# Altium schematic sheet micro_conflict-20171010-153445.SchDoc
size A4
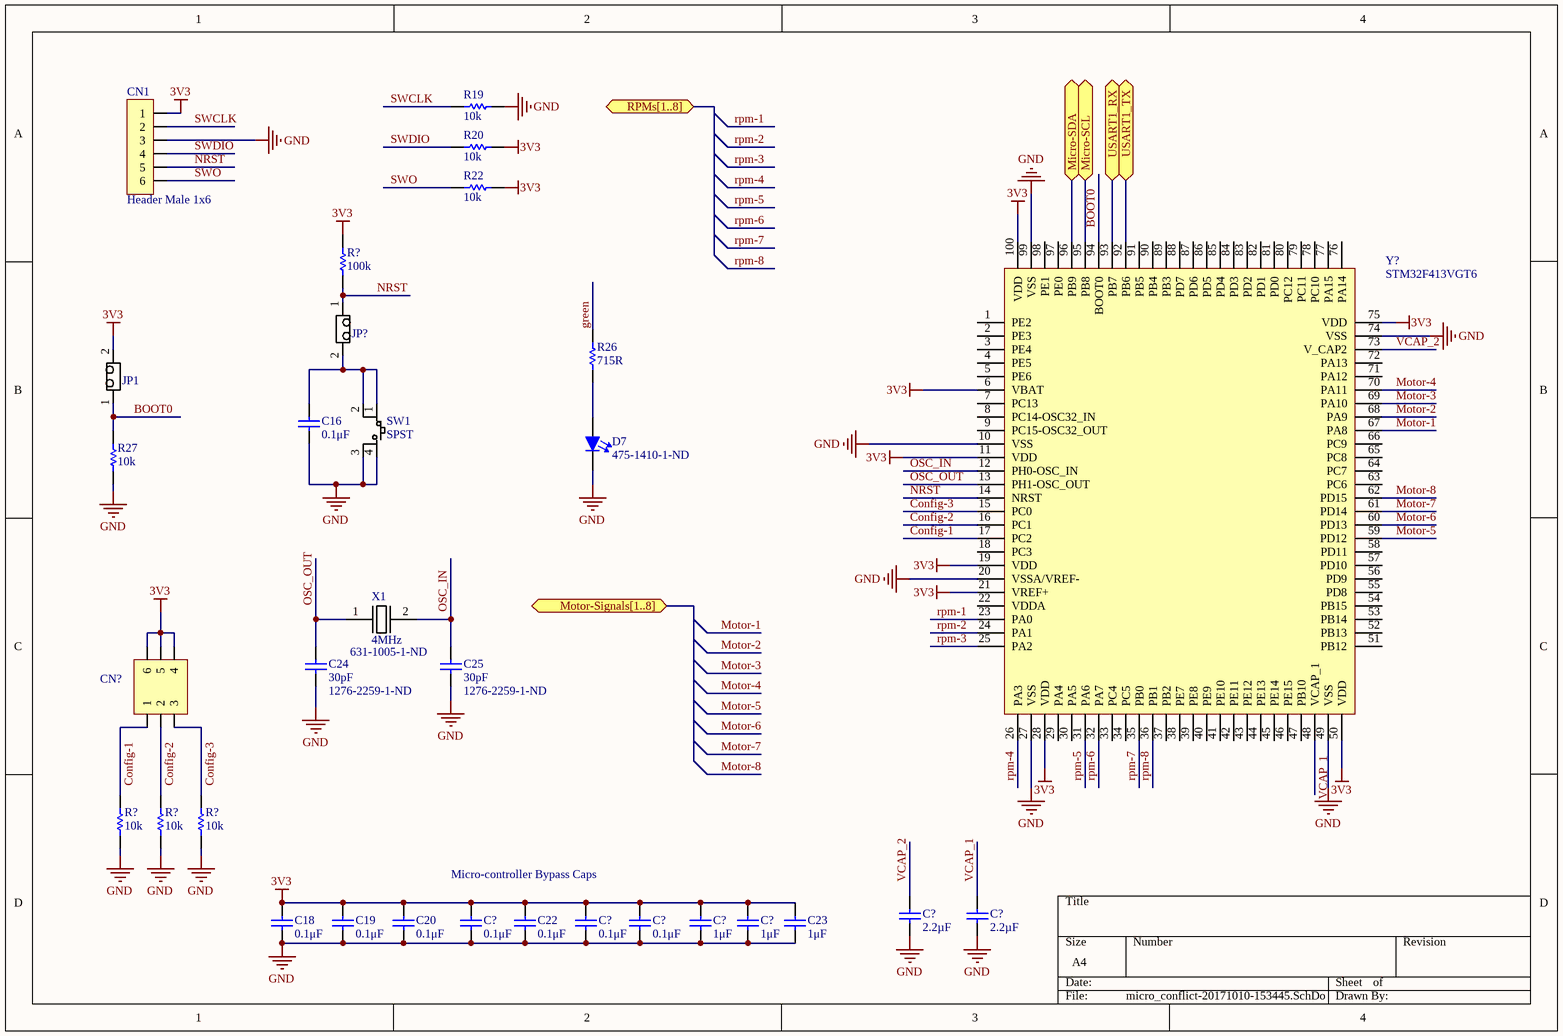
[diagram p0: micro_conflict-20171010-153445.SchDoc]

## Parts
(Parts that share a designator on the sheet are numbered #1, #2 ... from top to bottom, then left to right.)
C16  0.1μF  [CAPC1608N(0603")]
C18  0.1μF  [CAPC1608N(0603")]
C19  0.1μF  [CAPC1608N(0603")]
C20  0.1μF  [CAPC1608N(0603")]
C22  0.1μF  [CAPC1608N(0603")]
C23  1μF  [CAPC1608N(0603")]
C24  30pF  Supplier Part Number 1: 1276-2259-1-ND  [CAPC1608N(0603")]
C25  30pF  Supplier Part Number 1: 1276-2259-1-ND  [CAPC1608N(0603")]
C?#1  2.2µF  [CAPC1608N(0603")]
C?#2  2.2µF  [CAPC1608N(0603")]
C?#3  0.1μF  [CAPC1608N(0603")]
C?#4  0.1μF  [CAPC1608N(0603")]
C?#5  0.1μF  [CAPC1608N(0603")]
C?#6  1μF  [CAPC1608N(0603")]
C?#7  1μF  [CAPC1608N(0603")]
CN1  Header Male 1x6  [Header, Male, 1X6]
CN?  Header, Male, 2x3, Pitch: 0.1" (2.54mm), THT  [Header, Male, 2x3, Pitch: 0.1" (2.54mm),THT]  (value not drawn)
D7  Supplier Part Number 1: 475-1410-1-ND  [LED0805]  (hidden comment: Red)
JP1  1X2 Pin Head  [2X1 Males Header]  (value not drawn)
JP?  1X2 Pin Head  [2X1 Males Header]  (value not drawn)
R19  10k  [RESC1608N(0603")]
R20  10k  [RESC1608N(0603")]
R22  10k  [RESC1608N(0603")]
R26  715R  [RESC1608N(0603")]
R27  10k  [RESC1608N(0603")]
R?#1  100k  [RESC1608N(0603")]
R?#2  10k  [RESC1608N(0603")]
R?#3  10k  [RESC1608N(0603")]
R?#4  10k  [RESC1608N(0603")]
SW1  SPST  [4-SPST-NO]
X1  4MHz  Supplier Part Number 1: 631-1005-1-ND  [HC49/US]
Y?  STM32F413VGT6  [STM-LQFP100_M]

## Ports
Micro-SCL, Micro-SDA, Motor-Signals[1..8], RPMs[1..8], USART1_RX, USART1_TX

## Nets
3V3: C18.2(Cathode) C19.2(Cathode) C20.2(Cathode) C22.2(Cathode) C23.2(Cathode) C?#3.2(Cathode) C?#4.2(Cathode) C?#5.2(Cathode) C?#6.2(Cathode) C?#7.2(Cathode) CN1.1 CN?.4 CN?.5 CN?.6 JP1.2 R20.2 R22.2 R?#1.2 Y?.6(VBAT) Y?.11(VDD) Y?.19(VDD) Y?.21(VREF+) Y?.28(VDD) Y?.50(VDD) Y?.75(VDD) Y?.100(VDD)
GND: C16.1(Anode) C18.1(Anode) C19.1(Anode) C20.1(Anode) C22.1(Anode) C23.1(Anode) C24.1 C25.1 C?#1.1(Anode) C?#2.1(Anode) C?#3.1(Anode) C?#4.1(Anode) C?#5.1(Anode) C?#6.1(Anode) C?#7.1(Anode) CN1.3 D7.K(Cathode) R19.1 R27.1 R?#2.1 R?#3.1 R?#4.1 SW1.3 SW1.4 Y?.10(VSS) Y?.20(VSSA/VREF-) Y?.27(VSS) Y?.49(VSS) Y?.74(VSS) Y?.99(VSS)
BOOT0: JP1.1 R27.2 Y?.94(BOOT0)
Config-1: CN?.1 R?#2.2 Y?.17(PC2)
Config-2: CN?.2 R?#3.2 Y?.16(PC1)
Config-3: CN?.3 R?#4.2 Y?.15(PC0)
green: R26.2
Micro-SCL: Y?.95(PB8) ; port Micro-SCL
Micro-SDA: Y?.96(PB9) ; port Micro-SDA
Motor-1: Y?.67(PA8)
Motor-2: Y?.68(PA9)
Motor-3: Y?.69(PA10)
Motor-4: Y?.70(PA11)
Motor-5: Y?.59(PD12)
Motor-6: Y?.60(PD13)
Motor-7: Y?.61(PD14)
Motor-8: Y?.62(PD15)
NRST: CN1.5 JP?.1 R?#1.1 Y?.14(NRST)
OSC_IN: C25.2 X1.2 Y?.12(PH0-OSC_IN)
OSC_OUT: C24.2 X1.1 Y?.13(PH1-OSC_OUT)
rpm-1: Y?.23(PA0)
rpm-2: Y?.24(PA1)
rpm-3: Y?.25(PA2)
rpm-4: Y?.26(PA3)
rpm-5: Y?.31(PA6)
rpm-6: Y?.32(PA7)
rpm-7: Y?.35(PB0)
rpm-8: Y?.36(PB1)
SWCLK: CN1.2 R19.2
SWDIO: CN1.4 R20.1
SWO: CN1.6 R22.1
USART1_RX: Y?.93(PB7) ; port USART1_RX
USART1_TX: Y?.92(PB6) ; port USART1_TX
VCAP_1: C?#2.2(Cathode) Y?.48(VCAP_1)
VCAP_2: C?#1.2(Cathode) Y?.73(V_CAP2)
NetC16_2: C16.2(Cathode) JP?.2 SW1.1 SW1.2
NetD7_A: D7.A(Anode) R26.1

Not connected (* = marked no-connect by the designer): Y? 1(PE2) 2(PE3) 3(PE4) 4(PE5) 5(PE6) 7(PC13) 8(PC14-OSC32_IN) 9(PC15-OSC32_OUT) 18(PC3) 22(VDDA) 29(PA4) 30(PA5) 33(PC4) 34(PC5) 37(PB2) 38(PE7) 39(PE8) 40(PE9) 41(PE10) 42(PE11) 43(PE12) 44(PE13) 45(PE14) 46(PE15) 47(PB10) 51(PB12) 52(PB13) 53(PB14) 54(PB15) 55(PD8) 56(PD9) 57(PD10) 58(PD11) 63(PC6) 64(PC7) 65(PC8) 66(PC9) 71(PA12) 72(PA13) 76(PA14) 77(PA15) 78(PC10) 79(PC11) 80(PC12) 81(PD0) 82(PD1) 83(PD2) 84(PD3) 85(PD4) 86(PD5) 87(PD6) 88(PD7) 89(PB3) 90(PB4) 91(PB5) 97(PE0) 98(PE1)

## Notes on the sheet
- Micro-controller Bypass Caps

## Library data of the parts
C16 C18-C20 C22 C?#3-C?#5 = 0.1uF 100V 0603 SMD, Ceramic: Capacitor, Ceramic, 100V, +/- 10%, 0603 SMD, X7R; MFG: TDK; MFG#: CGA3E3X7S2A104K080AB; Published: 16-04-26; Publisher: AUVic; PackageDescription: Chip Capacitor; Value: 0.1μF; Created By: Ashwin Sira; Supplier 1: Digi-Key; Supplier Part Number 1: 445-6938-1-ND
C23 C?#6 C?#7 = 1uF 25V 0603 SMD, Ceramic: Capacitor, Ceramic, 25V, +/- 10%, 0603 SMD, X5R; MFG: Murata-Electronics-North-America; MFG#: GRM188R61E105KA12D; Published: 16-06-27; Publisher: AUVic; PackageDescription: Chip Capacitor; Value: 1μF; Created By: Andy Bates; Supplier 1: Digi-Key; Supplier Part Number 1: 490-3897-1-ND
C24 C25 = 30pF 50V 0603 SMD, Ceramic: Capacitor, Ceramic, 50V, +/-1%, 0603 SMD, C0G; Made By: Andy Bates; Published: 16-09-12; Publisher: AUVic; PackageDescription: Chip Capacitor; Value: 30pF; Supplier 1: Digi-Key
C?#1 C?#2 = 2.2uF, 50V, 0603 SMD, X5R, Ceramic: Capacitor, Ceramic, 50V, 10%, 0603 SMD, X5R; Date Created: *; PackageDescription: Chip Capacitor; Value: 2.2µF; Made By: *; Publisher: AUVic; Supplier 1: Digi-Key; Supplier Part Number 1: 490-10733-1-ND
CN1 = Header, Male, 1x6: 1x6, Pads Pitch: 0.1" (2.54mm), Through hole; Made By: Andy Bates; Supplier 1: Digi-Key; Supplier Part Number 1: 952-2270-ND
D7 = LED, 0805 (2012), Green, Clear: Colour: Red; Created By: Andy Bates; Supplier 1: Digi-Key
JP1 JP? = 1x2 Male Header: Made By: Andy Bates; Supplier 1: Digi-Key; Supplier Part Number 1: 952-3073-ND
R19 R20 R22 R27 R?#2-R?#4 = 10kR, 1%, 1/10W, 0603 SMD: Made By: Ashwin Sira; Owned By: AUVic; Created On: 14-05-31; Last Edited: 14-05-31; Supplier 1: Digi-Key; Supplier Part Number 1: 311-10.0KHRCT-ND; Value: 10k
R26 = 715R, 1%, 1/10W, 0603, SMD: Created By: Ashwin Sira; Publisher: AUVic; Date Created: 2016-06-10; Value: 715R; Supplier 1: Digi-Key; Supplier Part Number 1: 541-715HCT-ND
R?#1 = 100kR, 1%, 1/10W, 0603 SMD: Made By: Andy Bates; Owned By: AUVic; Created On: 14-06-30; Last Edited: 14-06-30; Value: 100k; Supplier 1: Digi-Key; Supplier Part Number 1: 311-100KGRCT-ND
SW1 = 4 pin Tacitle Switch: Made By: Andy Bates; Button Type: Single Pole Single Throw; Supplier 1: Digi-Key; Supplier Part Number 1: CKN9084CT-ND
X1 = Oscillator 4MHz: 4Mhz 150ESR  20pF -20°C ~ 70°C; Made By: Andy Bates; Supplier 1: Digi-Key
Y? = STM32F413VGT6: ARM Cortex-M4 32-bit MCU, 180 MHz, 320 KB Internal Rap, 81 I/O, 100-pin LQFP, -40 to 85 degC, Tray; Core Size: 32-bit; Supplier 1: Digi-Key; Supplier: Digikey; Supplier Part Number 1: 497-17009-ND
CN? = Header, Male, 2x3, Pitch: 0.1" (2.54mm), THT: Publisher: AUVic; Date Published: 2017-09-13; Last Updated: *; Reviewed By: *; Created By: Andy Bates